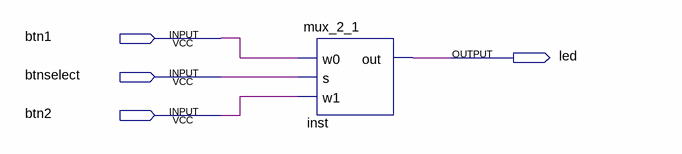
[diagram p0: schematic sheet]
// Quartus schematic tes_mux_2_1.bdf as structural Verilog: 1 symbols, 4 pins
module tes_mux_2_1 (
  input  btn1,
  input  btnselect,
  input  btn2,
  output led
);

  mux_2_1 inst (.w0(btn1), .s(btnselect), .w1(btn2), .out(led));
endmodule
